# EAGLE schematic MasterPCB_transfer (EAGLE 9.6.2), part 3 of 3
## Sheet 12 of 12: Microcontroller Page holds general connections made to the microcontroller and associated local hardware
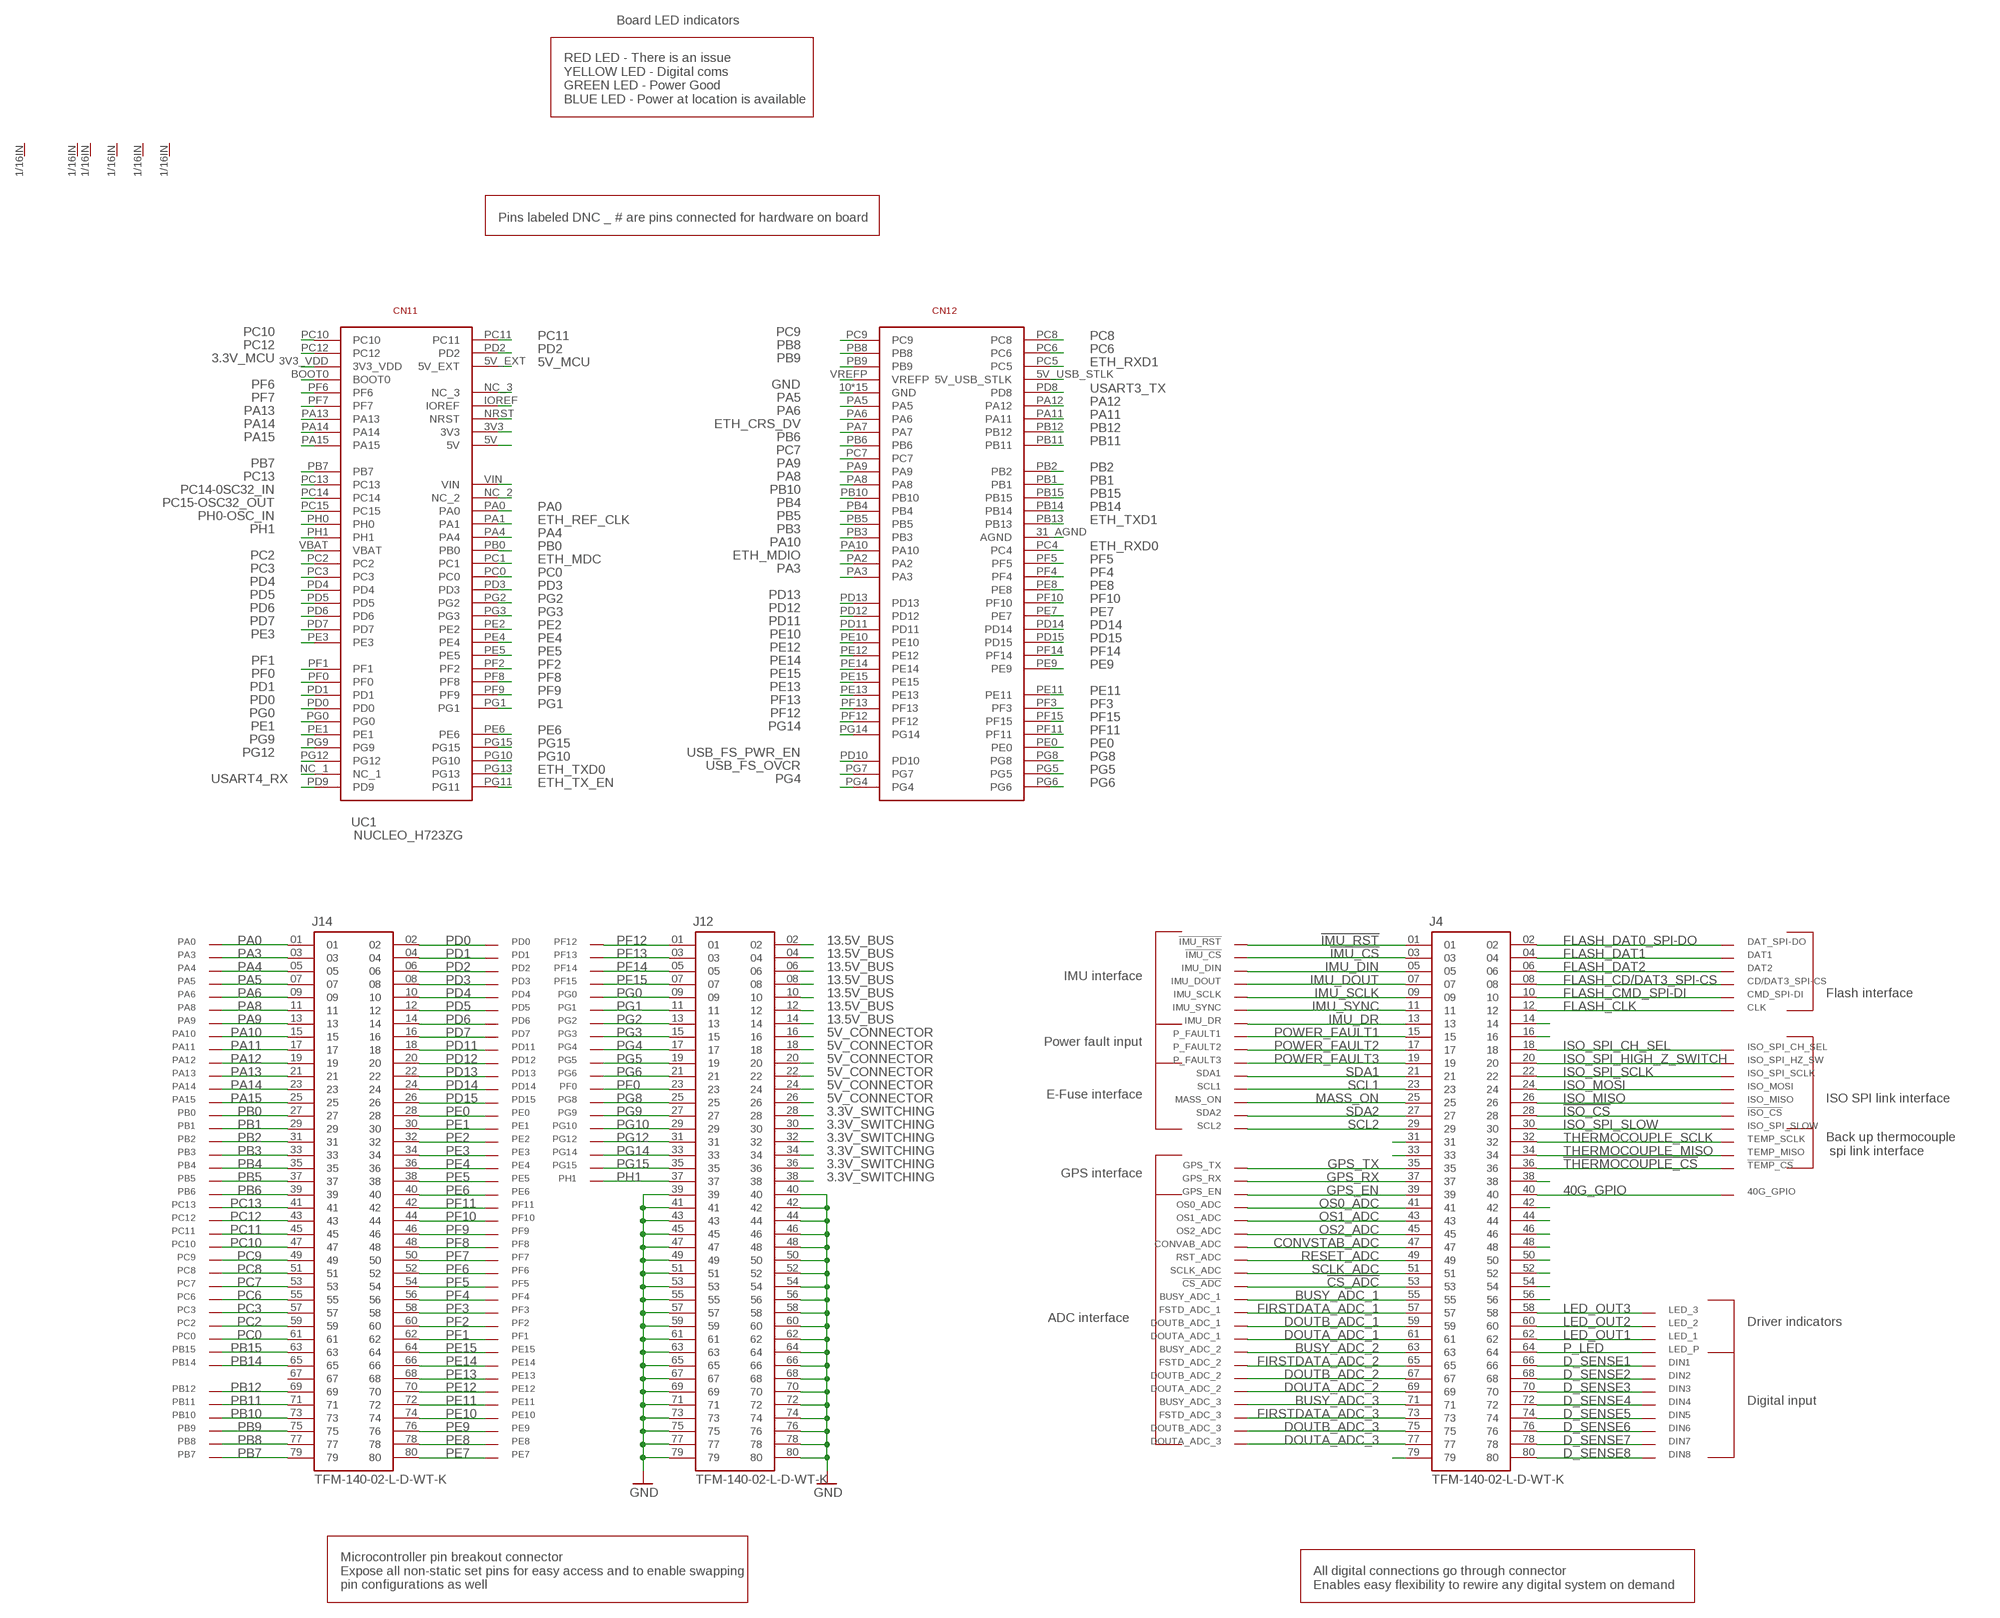
[diagram p20: schematic, sheet 12]

### Parts
40G_GPIO  SMALL_TP  [SMALL_TP]
!CS_ADC  SMALL_TP  [SMALL_TP]
!IMU_CS  SMALL_TP  [SMALL_TP]
!IMU_RST  SMALL_TP  [SMALL_TP]
!ISO_CS  SMALL_TP  [SMALL_TP]
!TEMP_CS  SMALL_TP  [SMALL_TP]
BUSY_ADC_1  SMALL_TP  [SMALL_TP]
BUSY_ADC_2  SMALL_TP  [SMALL_TP]
BUSY_ADC_3  SMALL_TP  [SMALL_TP]
CD/DAT3_SPI-CS  SMALL_TP  [SMALL_TP]
CLK  SMALL_TP  [SMALL_TP]
CMD_SPI-DI  SMALL_TP  [SMALL_TP]
CONVAB_ADC  SMALL_TP  [SMALL_TP]
DAT1  SMALL_TP  [SMALL_TP]
DAT2  SMALL_TP  [SMALL_TP]
DAT_SPI-DO  SMALL_TP  [SMALL_TP]
DIN1  SMALL_TP  [SMALL_TP]
DIN2  SMALL_TP  [SMALL_TP]
DIN3  SMALL_TP  [SMALL_TP]
DIN4  SMALL_TP  [SMALL_TP]
DIN5  SMALL_TP  [SMALL_TP]
DIN6  SMALL_TP  [SMALL_TP]
DIN7  SMALL_TP  [SMALL_TP]
DIN8  SMALL_TP  [SMALL_TP]
DOUTA_ADC_1  SMALL_TP  [SMALL_TP]
DOUTA_ADC_2  SMALL_TP  [SMALL_TP]
DOUTA_ADC_3  SMALL_TP  [SMALL_TP]
DOUTB_ADC_1  SMALL_TP  [SMALL_TP]
DOUTB_ADC_2  SMALL_TP  [SMALL_TP]
DOUTB_ADC_3  SMALL_TP  [SMALL_TP]
FSTD_ADC_1  SMALL_TP  [SMALL_TP]
FSTD_ADC_2  SMALL_TP  [SMALL_TP]
FSTD_ADC_3  SMALL_TP  [SMALL_TP]
GPS_EN  SMALL_TP  [SMALL_TP]
GPS_RX  SMALL_TP  [SMALL_TP]
GPS_TX  SMALL_TP  [SMALL_TP]
IMU_DIN  SMALL_TP  [SMALL_TP]
IMU_DOUT  SMALL_TP  [SMALL_TP]
IMU_DR  SMALL_TP  [SMALL_TP]
IMU_SCLK  SMALL_TP  [SMALL_TP]
IMU_SYNC  SMALL_TP  [SMALL_TP]
ISO_MISO  SMALL_TP  [SMALL_TP]
ISO_MOSI  SMALL_TP  [SMALL_TP]
ISO_SPI_CH_SEL  SMALL_TP  [SMALL_TP]
ISO_SPI_HZ_SW  SMALL_TP  [SMALL_TP]
ISO_SPI_SCLK  SMALL_TP  [SMALL_TP]
ISO_SPI_SLOW  SMALL_TP  [SMALL_TP]
J4  TFM-140-02-L-D-WT-K  [SAMTEC_TFM-140-02-L-D-WT-K]
J12  TFM-140-02-L-D-WT-K  [SAMTEC_TFM-140-02-L-D-WT-K]
J14  TFM-140-02-L-D-WT-K  [SAMTEC_TFM-140-02-L-D-WT-K]
LED_1  SMALL_TP  [SMALL_TP]
LED_2  SMALL_TP  [SMALL_TP]
LED_3  SMALL_TP  [SMALL_TP]
LED_P  SMALL_TP  [SMALL_TP]
MASS_ON  SMALL_TP  [SMALL_TP]
OS0_ADC  SMALL_TP  [SMALL_TP]
OS1_ADC  SMALL_TP  [SMALL_TP]
OS2_ADC  SMALL_TP  [SMALL_TP]
P_FAULT1  SMALL_TP  [SMALL_TP]
P_FAULT2  SMALL_TP  [SMALL_TP]
P_FAULT3  SMALL_TP  [SMALL_TP]
PA0  SMALL_TP  [SMALL_TP]
PA3  SMALL_TP  [SMALL_TP]
PA4  SMALL_TP  [SMALL_TP]
PA5  SMALL_TP  [SMALL_TP]
PA6  SMALL_TP  [SMALL_TP]
PA8  SMALL_TP  [SMALL_TP]
PA9  SMALL_TP  [SMALL_TP]
PA10  SMALL_TP  [SMALL_TP]
PA11  SMALL_TP  [SMALL_TP]
PA12  SMALL_TP  [SMALL_TP]
PA13  SMALL_TP  [SMALL_TP]
PA14  SMALL_TP  [SMALL_TP]
PA15  SMALL_TP  [SMALL_TP]
PB0  SMALL_TP  [SMALL_TP]
PB1  SMALL_TP  [SMALL_TP]
PB2  SMALL_TP  [SMALL_TP]
PB3  SMALL_TP  [SMALL_TP]
PB4  SMALL_TP  [SMALL_TP]
PB5  SMALL_TP  [SMALL_TP]
PB6  SMALL_TP  [SMALL_TP]
PB7  SMALL_TP  [SMALL_TP]
PB8  SMALL_TP  [SMALL_TP]
PB9  SMALL_TP  [SMALL_TP]
PB10  SMALL_TP  [SMALL_TP]
PB11  SMALL_TP  [SMALL_TP]
PB12  SMALL_TP  [SMALL_TP]
PB14  SMALL_TP  [SMALL_TP]
PB15  SMALL_TP  [SMALL_TP]
PC0  SMALL_TP  [SMALL_TP]
PC2  SMALL_TP  [SMALL_TP]
PC3  SMALL_TP  [SMALL_TP]
PC6  SMALL_TP  [SMALL_TP]
PC7  SMALL_TP  [SMALL_TP]
PC8  SMALL_TP  [SMALL_TP]
PC9  SMALL_TP  [SMALL_TP]
PC10  SMALL_TP  [SMALL_TP]
PC11  SMALL_TP  [SMALL_TP]
PC12  SMALL_TP  [SMALL_TP]
PC13  SMALL_TP  [SMALL_TP]
PD0  SMALL_TP  [SMALL_TP]
PD1  SMALL_TP  [SMALL_TP]
PD2  SMALL_TP  [SMALL_TP]
PD3  SMALL_TP  [SMALL_TP]
PD4  SMALL_TP  [SMALL_TP]
PD5  SMALL_TP  [SMALL_TP]
PD6  SMALL_TP  [SMALL_TP]
PD7  SMALL_TP  [SMALL_TP]
PD11  SMALL_TP  [SMALL_TP]
PD12  SMALL_TP  [SMALL_TP]
PD13  SMALL_TP  [SMALL_TP]
PD14  SMALL_TP  [SMALL_TP]
PD15  SMALL_TP  [SMALL_TP]
PE0  SMALL_TP  [SMALL_TP]
PE1  SMALL_TP  [SMALL_TP]
PE2  SMALL_TP  [SMALL_TP]
PE3  SMALL_TP  [SMALL_TP]
PE4  SMALL_TP  [SMALL_TP]
PE5  SMALL_TP  [SMALL_TP]
PE6  SMALL_TP  [SMALL_TP]
PE7  SMALL_TP  [SMALL_TP]
PE8  SMALL_TP  [SMALL_TP]
PE9  SMALL_TP  [SMALL_TP]
PE10  SMALL_TP  [SMALL_TP]
PE11  SMALL_TP  [SMALL_TP]
PE12  SMALL_TP  [SMALL_TP]
PE13  SMALL_TP  [SMALL_TP]
PE14  SMALL_TP  [SMALL_TP]
PE15  SMALL_TP  [SMALL_TP]
PF0  SMALL_TP  [SMALL_TP]
PF1  SMALL_TP  [SMALL_TP]
PF2  SMALL_TP  [SMALL_TP]
PF3  SMALL_TP  [SMALL_TP]
PF4  SMALL_TP  [SMALL_TP]
PF5  SMALL_TP  [SMALL_TP]
PF6  SMALL_TP  [SMALL_TP]
PF7  SMALL_TP  [SMALL_TP]
PF8  SMALL_TP  [SMALL_TP]
PF9  SMALL_TP  [SMALL_TP]
PF10  SMALL_TP  [SMALL_TP]
PF11  SMALL_TP  [SMALL_TP]
PF12  SMALL_TP  [SMALL_TP]
PF13  SMALL_TP  [SMALL_TP]
PF14  SMALL_TP  [SMALL_TP]
PF15  SMALL_TP  [SMALL_TP]
PG0  SMALL_TP  [SMALL_TP]
PG1  SMALL_TP  [SMALL_TP]
PG2  SMALL_TP  [SMALL_TP]
PG3  SMALL_TP  [SMALL_TP]
PG4  SMALL_TP  [SMALL_TP]
PG5  SMALL_TP  [SMALL_TP]
PG6  SMALL_TP  [SMALL_TP]
PG8  SMALL_TP  [SMALL_TP]
PG9  SMALL_TP  [SMALL_TP]
PG10  SMALL_TP  [SMALL_TP]
PG12  SMALL_TP  [SMALL_TP]
PG14  SMALL_TP  [SMALL_TP]
PG15  SMALL_TP  [SMALL_TP]
PH1  SMALL_TP  [SMALL_TP]
RST_ADC  SMALL_TP  [SMALL_TP]
SCL1  SMALL_TP  [SMALL_TP]
SCL2  SMALL_TP  [SMALL_TP]
SCLK_ADC  SMALL_TP  [SMALL_TP]
SDA1  SMALL_TP  [SMALL_TP]
SDA2  SMALL_TP  [SMALL_TP]
TEMP_MISO  SMALL_TP  [SMALL_TP]
TEMP_SCLK  SMALL_TP  [SMALL_TP]
U$5  THROUGH_HOLE  [1/16TH_BOLT]
U$7  THROUGH_HOLE  [1/16TH_BOLT]
U$9  THROUGH_HOLE  [1/16TH_BOLT]
U$10  THROUGH_HOLE  [1/16TH_BOLT]
U$14  THROUGH_HOLE  [1/16TH_BOLT]
U$15  THROUGH_HOLE  [1/16TH_BOLT]
UC1  NUCLEO_H723ZG  [NUCLEO_H723ZG]

### Nets
3.3V_MCU: UC1.3V3_VDD
3.3V_SWITCHING: J12.28 J12.30 J12.32 J12.34 J12.36 J12.38 ; also sheet 3,4
5V_CONNECTOR: J12.16 J12.18 J12.20 J12.22 J12.24 J12.26 ; also sheet 4
5V_MCU: UC1.5V_EXT ; also sheet 4
13.5V_BUS: J12.02 J12.04 J12.06 J12.08 J12.10 J12.12 J12.14 ; also sheet 2,4,5,6,11
40G_GPIO: 40G_GPIO.TP J4.40 ; also sheet 11
!CS_ADC: !CS_ADC.TP J4.53 ; also sheet 1,2
!IMU_CS: !IMU_CS.TP J4.03 ; also sheet 8
!IMU_RST: !IMU_RST.TP J4.01 ; also sheet 8
!ISO_CS: !ISO_CS.TP J4.28 ; also sheet 9
!THERMOCOUPLE_CS: !TEMP_CS.TP J4.36 ; also sheet 11
BUSY_ADC_1: BUSY_ADC_1.TP J4.55 ; also sheet 1
BUSY_ADC_2: BUSY_ADC_2.TP J4.63 ; also sheet 1
BUSY_ADC_3: BUSY_ADC_3.TP J4.71 ; also sheet 2
CONVSTAB_ADC: CONVAB_ADC.TP J4.47 ; also sheet 1,2
D_SENSE1: DIN1.TP J4.66 ; also sheet 3
D_SENSE2: DIN2.TP J4.68 ; also sheet 3
D_SENSE3: DIN3.TP J4.70 ; also sheet 3
D_SENSE4: DIN4.TP J4.72 ; also sheet 3
D_SENSE5: DIN5.TP J4.74 ; also sheet 3
D_SENSE6: DIN6.TP J4.76 ; also sheet 3
D_SENSE7: DIN7.TP J4.78 ; also sheet 3
D_SENSE8: DIN8.TP J4.80 ; also sheet 3
DOUTA_ADC_1: DOUTA_ADC_1.TP J4.61 ; also sheet 1
DOUTA_ADC_2: DOUTA_ADC_2.TP J4.69 ; also sheet 1
DOUTA_ADC_3: DOUTA_ADC_3.TP J4.77 ; also sheet 2
DOUTB_ADC_1: DOUTB_ADC_1.TP J4.59 ; also sheet 1
DOUTB_ADC_2: DOUTB_ADC_2.TP J4.67 ; also sheet 1
DOUTB_ADC_3: DOUTB_ADC_3.TP J4.75 ; also sheet 2
ETH_CRS_DV: UC1.PA7
ETH_MDC: UC1.PC1
ETH_MDIO: UC1.PA2
ETH_REF_CLK: UC1.PA1
ETH_RXD0: UC1.PC4
ETH_RXD1: UC1.PC5
ETH_TX_EN: UC1.PG11
ETH_TXD0: UC1.PG13
ETH_TXD1: UC1.PB13
FIRSTDATA_ADC_1: FSTD_ADC_1.TP J4.57 ; also sheet 1
FIRSTDATA_ADC_2: FSTD_ADC_2.TP J4.65 ; also sheet 1
FIRSTDATA_ADC_3: FSTD_ADC_3.TP J4.73 ; also sheet 2
FLASH_CD/DAT3_SPI-CS: CD/DAT3_SPI-CS.TP J4.08 ; also sheet 10
FLASH_CLK: CLK.TP J4.12 ; also sheet 10
FLASH_CMD_SPI-DI: CMD_SPI-DI.TP J4.10 ; also sheet 10
FLASH_DAT0_SPI-DO: DAT_SPI-DO.TP J4.02 ; also sheet 10
FLASH_DAT1: DAT1.TP J4.04 ; also sheet 10
FLASH_DAT2: DAT2.TP J4.06 ; also sheet 10
GND: J12.39 J12.40 J12.41 J12.42 J12.43 J12.44 J12.45 J12.46 J12.47 J12.48 J12.49 J12.50 J12.51 J12.52 J12.53 J12.54 J12.55 J12.56 J12.57 J12.58 J12.59 J12.60 J12.61 J12.62 J12.63 J12.64 J12.65 J12.66 J12.67 J12.68 J12.69 J12.70 J12.71 J12.72 J12.73 J12.74 J12.75 J12.76 J12.77 J12.78 J12.79 J12.80 UC1.10(GND) UC1.19(GND) UC1.40(GND) UC1.53(GND) UC1.64(GND) UC1.71(GND) UC1.72(GND) UC1.79(GND) UC1.91(GND) UC1.92(GND) UC1.93(GND) UC1.122(GND) UC1.131(GND) UC1.143(GND) UC1.144(GND) ; also sheet 1,2,3,4,5,6,7,8,9,10,11
GPS_EN: GPS_EN.TP J4.39 ; also sheet 7
GPS_RX: GPS_RX.TP J4.37 ; also sheet 7
GPS_TX: GPS_TX.TP J4.35 ; also sheet 7
IMU_DIN: IMU_DIN.TP J4.05 ; also sheet 8
IMU_DOUT: IMU_DOUT.TP J4.07 ; also sheet 8
IMU_DR: IMU_DR.TP J4.13 ; also sheet 8
IMU_SCLK: IMU_SCLK.TP J4.09 ; also sheet 8
IMU_SYNC: IMU_SYNC.TP J4.11 ; also sheet 8
ISO_MISO: ISO_MISO.TP J4.26 ; also sheet 9
ISO_MOSI: ISO_MOSI.TP J4.24 ; also sheet 9
ISO_SPI_CH_SEL: ISO_SPI_CH_SEL.TP J4.18 ; also sheet 9
ISO_SPI_HIGH_Z_SWITCH: ISO_SPI_HZ_SW.TP J4.20 ; also sheet 9
ISO_SPI_SCLK: ISO_SPI_SCLK.TP J4.22 ; also sheet 9
ISO_SPI_SLOW: ISO_SPI_SLOW.TP J4.30 ; also sheet 9
LED_OUT1: J4.62 LED_1.TP ; also sheet 3
LED_OUT2: J4.60 LED_2.TP ; also sheet 3
LED_OUT3: J4.58 LED_3.TP ; also sheet 3
MASS_ON: J4.25 MASS_ON.TP ; also sheet 11
N$2: J4.14
N$3: J4.16
N$4: J4.38
N$8: J4.56
N$9: J4.54
N$10: J4.52
N$11: J4.50
N$12: J4.48
N$13: J4.46
N$14: J4.44
N$15: J4.42
N$16: J4.31
N$20: J4.33
N$21: J4.79
N$554: UC1.BOOT0
N$566: UC1.VBAT
N$582: UC1.NC_1
N$605: UC1.NC_2
N$606: UC1.VIN
N$607: UC1.5V
N$608: UC1.3V3
N$609: UC1.NRST
N$610: UC1.IOREF
N$611: UC1.NC_3
N$618: UC1.VREFP
N$666: UC1.31_AGND(AGND)
N$677: UC1.5V_USB_STLK
OS0_ADC: J4.41 OS0_ADC.TP ; also sheet 1,2
OS1_ADC: J4.43 OS1_ADC.TP ; also sheet 1,2
OS2_ADC: J4.45 OS2_ADC.TP ; also sheet 1,2
P_LED: J4.64 LED_P.TP ; also sheet 3
PA0: J14.01 PA0.TP UC1.PA0
PA3: J14.03 PA3.TP UC1.PA3
PA4: J14.05 PA4.TP UC1.PA4
PA5: J14.07 PA5.TP UC1.PA5
PA6: J14.09 PA6.TP UC1.PA6
PA8: J14.11 PA8.TP UC1.PA8
PA9: J14.13 PA9.TP UC1.PA9
PA10: J14.15 PA10.TP UC1.PA10
PA11: J14.17 PA11.TP UC1.PA11
PA12: J14.19 PA12.TP UC1.PA12
PA13: J14.21 PA13.TP UC1.PA13
PA14: J14.23 PA14.TP UC1.PA14
PA15: J14.25 PA15.TP UC1.PA15
PB0: J14.27 PB0.TP UC1.PB0
PB1: J14.29 PB1.TP UC1.PB1
PB2: J14.31 PB2.TP UC1.PB2
PB3: J14.33 PB3.TP UC1.PB3
PB4: J14.35 PB4.TP UC1.PB4
PB5: J14.37 PB5.TP UC1.PB5
PB6: J14.39 PB6.TP UC1.PB6
PB7: J14.79 PB7.TP UC1.PB7
PB8: J14.77 PB8.TP UC1.PB8
PB9: J14.75 PB9.TP UC1.PB9
PB10: J14.73 PB10.TP UC1.PB10
PB11: J14.71 PB11.TP UC1.PB11
PB12: J14.69 PB12.TP UC1.PB12
PB14: J14.65 PB14.TP UC1.PB14
PB15: J14.63 PB15.TP UC1.PB15
PC0: J14.61 PC0.TP UC1.PC0
PC2: J14.59 PC2.TP UC1.PC2
PC3: J14.57 PC3.TP UC1.PC3
PC6: J14.55 PC6.TP UC1.PC6
PC7: J14.53 PC7.TP UC1.PC7
PC8: J14.51 PC8.TP UC1.PC8
PC9: J14.49 PC9.TP UC1.PC9
PC10: J14.47 PC10.TP UC1.PC10
PC11: J14.45 PC11.TP UC1.PC11
PC12: J14.43 PC12.TP UC1.PC12
PC13: J14.41 PC13.TP UC1.PC13
PC14-0SC32_IN: UC1.PC14
PC15-OSC32_OUT: UC1.PC15
PD0: J14.02 PD0.TP UC1.PD0
PD1: J14.04 PD1.TP UC1.PD1
PD2: J14.06 PD2.TP UC1.PD2
PD3: J14.08 PD3.TP UC1.PD3
PD4: J14.10 PD4.TP UC1.PD4
PD5: J14.12 PD5.TP UC1.PD5
PD6: J14.14 PD6.TP UC1.PD6
PD7: J14.16 PD7.TP UC1.PD7
PD11: J14.18 PD11.TP UC1.PD11
PD12: J14.20 PD12.TP UC1.PD12
PD13: J14.22 PD13.TP UC1.PD13
PD14: J14.24 PD14.TP UC1.PD14
PD15: J14.26 PD15.TP UC1.PD15
PE0: J14.28 PE0.TP UC1.PE0
PE1: J14.30 PE1.TP UC1.PE1
PE2: J14.32 PE2.TP UC1.PE2
PE3: J14.34 PE3.TP UC1.PE3
PE4: J14.36 PE4.TP UC1.PE4
PE5: J14.38 PE5.TP UC1.PE5
PE6: J14.40 PE6.TP UC1.PE6
PE7: J14.80 PE7.TP UC1.PE7
PE8: J14.78 PE8.TP UC1.PE8
PE9: J14.76 PE9.TP UC1.PE9
PE10: J14.74 PE10.TP UC1.PE10
PE11: J14.72 PE11.TP UC1.PE11
PE12: J14.70 PE12.TP UC1.PE12
PE13: J14.68 PE13.TP UC1.PE13
PE14: J14.66 PE14.TP UC1.PE14
PE15: J14.64 PE15.TP UC1.PE15
PF0: J12.23 PF0.TP UC1.PF0
PF1: J14.62 PF1.TP UC1.PF1
PF2: J14.60 PF2.TP UC1.PF2
PF3: J14.58 PF3.TP UC1.PF3
PF4: J14.56 PF4.TP UC1.PF4
PF5: J14.54 PF5.TP UC1.PF5
PF6: J14.52 PF6.TP UC1.PF6
PF7: J14.50 PF7.TP UC1.PF7
PF8: J14.48 PF8.TP UC1.PF8
PF9: J14.46 PF9.TP UC1.PF9
PF10: J14.44 PF10.TP UC1.PF10
PF11: J14.42 PF11.TP UC1.PF11
PF12: J12.01 PF12.TP UC1.PF12
PF13: J12.03 PF13.TP UC1.PF13
PF14: J12.05 PF14.TP UC1.PF14
PF15: J12.07 PF15.TP UC1.PF15
PG0: J12.09 PG0.TP UC1.PG0
PG1: J12.11 PG1.TP UC1.PG1
PG2: J12.13 PG2.TP UC1.PG2
PG3: J12.15 PG3.TP UC1.PG3
PG4: J12.17 PG4.TP UC1.PG4
PG5: J12.19 PG5.TP UC1.PG5
PG6: J12.21 PG6.TP UC1.PG6
PG8: J12.25 PG8.TP UC1.PG8
PG9: J12.27 PG9.TP UC1.PG9
PG10: J12.29 PG10.TP UC1.PG10
PG12: J12.31 PG12.TP UC1.PG12
PG14: J12.33 PG14.TP UC1.PG14
PG15: J12.35 PG15.TP UC1.PG15
PH0-OSC_IN: UC1.PH0
PH1: J12.37 PH1.TP UC1.PH1
POWER_FAULT1: J4.15 P_FAULT1.TP ; also sheet 4
POWER_FAULT2: J4.17 P_FAULT2.TP ; also sheet 4
POWER_FAULT3: J4.19 P_FAULT3.TP ; also sheet 4
RESET_ADC: J4.49 RST_ADC.TP ; also sheet 1,2
SCL1: J4.23 SCL1.TP ; also sheet 11
SCL2: J4.29 SCL2.TP ; also sheet 11
SCLK_ADC: J4.51 SCLK_ADC.TP ; also sheet 1,2
SDA1: J4.21 SDA1.TP ; also sheet 11
SDA2: J4.27 SDA2.TP ; also sheet 11
THERMOCOUPLE_MISO: J4.34 TEMP_MISO.TP ; also sheet 11
THERMOCOUPLE_SCLK: J4.32 TEMP_SCLK.TP ; also sheet 11
USART3_TX: UC1.PD8
USART4_RX: UC1.PD9
USB_FS_OVCR: UC1.PG7
USB_FS_PWR_EN: UC1.PD10
Unconnected: J14.67 U$5.1/16IN(THROUGH_HOLE) U$7.1/16IN(THROUGH_HOLE) U$9.1/16IN(THROUGH_HOLE) U$10.1/16IN(THROUGH_HOLE) U$14.1/16IN(THROUGH_HOLE) U$15.1/16IN(THROUGH_HOLE)

### Notes on the sheet
- Board LED indicators
- RED LED - There is an issue 
  YELLOW LED - Digital coms
  GREEN LED - Power Good
  BLUE LED - Power at location is available
- Pins labeled DNC _ # are pins connected for hardware on board
- IMU interface
- Flash interface
- Power fault input
- E-Fuse interface
- ISO SPI link interface
- Back up thermocouple
   spi link interface
- GPS interface
- ADC interface
- Driver indicators
- Digital input
- Microcontroller pin breakout connector
  Expose all non-static set pins for easy access and to enable swapping
  pin configurations as well
- All digital connections go through connector
  Enables easy flexibility to rewire any digital system on demand

## Library data of the parts
40G_GPIO !CS_ADC !IMU_CS !IMU_RST !ISO_CS !TEMP_CS BUSY_ADC_1-BUSY_ADC_3 CD/DAT3_SPI-CS CLK CMD_SPI-DI CONVAB_ADC DAT1 DAT2 DAT_SPI-DO DIN1-DIN8 DOUTA_ADC_1-DOUTA_ADC_3 DOUTB_ADC_1-DOUTB_ADC_3 FSTD_ADC_1-FSTD_ADC_3 GPS_EN GPS_RX GPS_TX IMU_DIN IMU_DOUT IMU_DR IMU_SCLK IMU_SYNC ISO_MISO ISO_MOSI ISO_SPI_CH_SEL ISO_SPI_HZ_SW ISO_SPI_SCLK ISO_SPI_SLOW LED_1-LED_3 LED_P MASS_ON OS0_ADC OS1_ADC OS2_ADC P_FAULT1-P_FAULT3 PA0 PA3-PA6 PA8-PA15 PB0 PB1-PB12 PB14 PB15 PC0 PC2 PC3 PC6-PC13 PD0 PD1-PD7 PD11-PD15 PE0 PE1-PE15 PF0 PF1-PF15 PG0 PG1-PG6 PG8-PG10 PG12 PG14 PG15 PH1 RST_ADC SCL1 SCL2 SCLK_ADC SDA1 SDA2 TEMP_MISO TEMP_SCLK = SamacSys_Parts:SMALL_TP
C1 C13 C16 C17 C22 C25 C27 C96 C98 C100 C102-C106 C108-C110 = SamacSys_Parts:C3216X7R1E106K160AE: TDK 1206 C 10uF Ceramic Multilayer Capacitor, 25 V dc, +125C, X7R Dielectric, +/-10% Source: Datasheet <https://componentsearchengine.com/Datasheets/1/C3216X7R1E106K160AE.pdf>; DESCRIPTION: TDK 1206 C 10uF Ceramic Multilayer Capacitor, 25 V dc, +125C, X7R Dielectric, +/-10%; HEIGHT: 0.75mm; MANUFACTURER_NAME: TDK; MANUFACTURER_PART_NUMBER: C3216X7R1E106K160AE; MOUSER_PART_NUMBER: 810-C3216X7R1E106KST; MOUSER_PRICE-STOCK: https://www.mouser.com/Search/Refine.aspx?Keyword=810-C3216X7R1E106KST
C2-C12 C14 C15 C18-C21 C23 C24 C173 C174 C190 C196 = SamacSys_Parts:CGA4J3X7R1H105K125AB: Multilayer Ceramic Capacitors MLCC - SMD/SMT CGA 0805 50V 1uF X7R 10% AEC-Q200 Source: Datasheet <https://product.tdk.com/system/files/dam/doc/product/capacitor/ceramic/mlcc/catalog/mlcc_automotive_general_en.pdf?ref_disty=mouser>; DESCRIPTION: Multilayer Ceramic Capacitors MLCC - SMD/SMT CGA 0805 50V 1uF X7R 10% AEC-Q200; HEIGHT: 1.25mm; MANUFACTURER_NAME: TDK; MANUFACTURER_PART_NUMBER: CGA4J3X7R1H105K125AB; MOUSER_PART_NUMBER: 810-CGA4J3X7R1H105K; MOUSER_STOCK_PRICE: https://www.mouser.com/ProductDetail/TDK/CGA4J3X7R1H105K125AB?qs=NRhsANhppD9cK8XQyI1JTg%3D%3D
C26 C33-C36 C41 C46 C65 C70-C73 C107 C116 C121 C126 C131 C136 C141 C146 C151 C156 C161 C166 C169 C170 C189 C191-C195 = SamacSys_Parts:GRM31C5C1E474JE01L: Multilayer Ceramic Capacitors MLCC - SMD/SMT Source: Datasheet; DESCRIPTION: Multilayer Ceramic Capacitors MLCC - SMD/SMT; HEIGHT: 1.8mm; MANUFACTURER_NAME: Murata Electronics; MANUFACTURER_PART_NUMBER: GRM31C5C1E474JE01L; MOUSER_PART_NUMBER: 81-GRM31C5C1E474JE1L; MOUSER_PRICE-STOCK: https://www.mouser.co.uk/ProductDetail/Murata-Electronics/GRM31C5C1E474JE01L?qs=hd1VzrDQEGj8GOC097EZLg%3D%3D
C28-C30 C39 C45 C48-C52 C54 C56-C60 C62 C74-C77 C79-C85 C87-C89 C101 C115 C120 C125 C130 C135 C140 C145 C150 C155 C160 C165 C176-C180 C182-C188 C197 C198 C200-C204 C206-C210 C212-C216 C218-C222 C224-C228 C230-C234 C236-C240 C242-C246 C248-C252 C254-C258 C260-C264 C266-C270 C272-C276 = SamacSys_Parts:CS0402KRX7R8BB104: CS0402KRX7R8BB104 Source: Datasheet; DESCRIPTION: CS0402KRX7R8BB104; HEIGHT: 0.65mm; MANUFACTURER_NAME: YAGEO (PHYCOMP); MANUFACTURER_PART_NUMBER: CS0402KRX7R8BB104; MOUSER_PART_NUMBER: 603-CS0402KRX78BB104; MOUSER_PRICE-STOCK: https://www.mouser.co.uk/ProductDetail/Yageo/CS0402KRX7R8BB104?qs=OCVh8QRf89CevdcE88rDSA%3D%3D
C37 C42-C44 C95 C97 C99 C112-C114 C117-C119 C122-C124 C127-C129 C132-C134 C137-C139 C142-C144 C147-C149 C152-C154 C157-C159 C162-C164 C167 C168 = SamacSys_Parts:GRM1555C1H822JE01D: Multilayer Ceramic Capacitors MLCC - SMD/SMT 8200pF
C38 C40 C63 C64 C66-C69 = SamacSys_Parts:CGA2B2C0G1H102J050BE: Multilayer Ceramic Capacitors MLCC - SMD/SMT 0402 50VDC 1nF 5% C0G AEC-Q200 Source: Datasheet <https://product.tdk.com/system/files/dam/doc/product/capacitor/ceramic/mlcc/catalog/mlcc_automotive_soft_en.pdf>; DESCRIPTION: Multilayer Ceramic Capacitors MLCC - SMD/SMT 0402 50VDC 1nF 5% C0G AEC-Q200; HEIGHT: 0.55mm; MANUFACTURER_NAME: TDK; MANUFACTURER_PART_NUMBER: CGA2B2C0G1H102J050BE; MOUSER_PART_NUMBER: 810-CGA2B2C0G1H102J5; MOUSER_PRICE-STOCK: https://www.mouser.co.uk/ProductDetail/TDK/CGA2B2C0G1H102J050BE?qs=P1JMDcb91o7BA6xd7%2FtTJw%3D%3D
C47 C53 C55 C61 C78 C86 C175 C181 C199 C205 C211 C217 C223 C229 C235 C241 C247 C253 C259 C265 C271 = SamacSys_Parts:C0402C103K3RAC7411: SMD Comm X7R, Ceramic, 0.01 uF, 10%, 25 VDC, 62.5 VDC, 125?C, -55?C, X7R, SMD, MLCC, Temperature Stable, Class II, 3.5 % , 100 GOhms, 1.21 mg, 0402, 1mm, 0.5mm, 0.5mm, 0.3mm, 0.3mm, 50000, 78 Weeks, 80 Source: Datasheet <https://content.kemet.com/datasheets/KEM_C1002_X7R_SMD.pdf>; DESCRIPTION: SMD Comm X7R, Ceramic, 0.01 uF, 10%, 25 VDC, 62.5 VDC, 125?C, -55?C, X7R, SMD, MLCC, Temperature Stable, Class II, 3.5 % , 100 GOhms, 1.21 mg, 0402, 1mm, 0.5mm, 0.5mm, 0.3mm, 0.3mm, 50000, 78 Weeks, 80; HEIGHT: 0.55mm; MANUFACTURER_NAME: KEMET; MANUFACTURER_PART_NUMBER: C0402C103K3RAC7411; MOUSER_PART_NUMBER: 80-C0402C103K3R7411; MOUSER_PRICE-STOCK: https://www.mouser.co.uk/ProductDetail/KEMET/C0402C103K3RAC7411?qs=A9KPa1hU2BRAaYVIc6Z8hw%3D%3D
C111 = SamacSys_Parts:GRT21BC8YA475KE13K: Capacitor GRT21 L=2.0mm W=1.25mm T=1.25mm Source: Datasheet <https://psearch.en.murata.com/capacitor/product/GRT21BC8YA475KE13#.html>; DESCRIPTION: Capacitor GRT21 L=2.0mm W=1.25mm T=1.25mm; HEIGHT: 1.35mm; MANUFACTURER_NAME: Murata Electronics; MANUFACTURER_PART_NUMBER: GRT21BC8YA475KE13K; MOUSER_PART_NUMBER: 81-GRT21BC8YA475KE3K; MOUSER_PRICE-STOCK: https://www.mouser.co.uk/ProductDetail/Murata-Electronics/GRT21BC8YA475KE13K?qs=d0WKAl%252BL4KbclushYQ%252Bahg%3D%3D
C171 C172 = SamacSys_Parts:06035C270JAT2A: Capacitor, 0603 27PF +/-5% 50V Source: Datasheet <https://componentsearchengine.com/Datasheets/1/06031A100FAT2A.pdf>; DESCRIPTION: Capacitor, 0603 27PF +/-5% 50V; HEIGHT: 0.9mm; MANUFACTURER_NAME: AVX; MANUFACTURER_PART_NUMBER: 06035C270JAT2A
D1-D44 D46 D47 D49-D74 D76 D77 = SamacSys_Parts:PTVS12VS1UR,115: PTVSxS1UR series - 400 W Transient Voltage Suppressor Source: Datasheet <https://assets.nexperia.com/documents/data-sheet/PTVSXS1UR_SER.pdf>; DESCRIPTION: PTVSxS1UR series - 400 W Transient Voltage Suppressor; HEIGHT: mm; MANUFACTURER_NAME: Nexperia; MANUFACTURER_PART_NUMBER: PTVS12VS1UR,115; MOUSER_PART_NUMBER: 771-PTVS12VS1UR115; MOUSER_PRICE-STOCK: https://www.mouser.co.uk/ProductDetail/Nexperia/PTVS12VS1UR115?qs=LMSg3oBIm%2FiWSHvsyxWiLg%3D%3D
D45 D48 D75 D78-D82 D84-D87 = SamacSys_Parts:RSR025N03HZGTL: MOSFET 30V N-CHANNEL 2.5A Source: Datasheet <https://componentsearchengine.com/Datasheets/2/RSR025N03HZGTL.pdf>; DESCRIPTION: MOSFET 30V N-CHANNEL 2.5A; HEIGHT: 1mm; MANUFACTURER_NAME: ROHM Semiconductor; MANUFACTURER_PART_NUMBER: RSR025N03HZGTL; MOUSER_PART_NUMBER: 755-RSR025N03HZGTL; MOUSER_PRICE-STOCK: https://www.mouser.co.uk/ProductDetail/ROHM-Semiconductor/RSR025N03HZGTL?qs=qSfuJ%252Bfl%2Fd6oUAHuBzgCAw%3D%3D
IC1-IC3 IC24-IC30 IC35-IC37 IC39-IC50 IC53-IC79 = SamacSys_Parts:NCS21911SN2T1G: Operational Amplifiers - Op Amps 2 MHz Source: Datasheet <https://www.arrow.com/en/products/ncs21911sn2t1g/on-semiconductor>; DESCRIPTION: Operational Amplifiers - Op Amps 2 MHz; HEIGHT: 1.1mm; MANUFACTURER_NAME: ON Semiconductor; MANUFACTURER_PART_NUMBER: NCS21911SN2T1G; MOUSER_PART_NUMBER: 863-NCS21911SN2T1G; MOUSER_PRICE-STOCK: https://www.mouser.co.uk/ProductDetail/onsemi/NCS21911SN2T1G?qs=%252B6g0mu59x7Ix%2FTFBhvJ5Cw%3D%3D
IC4 IC11-IC23 = SamacSys_Parts:LTC4222CUH#PBF: Hot Swap Voltage Controllers Dual Hot Swap Controller w/ADC and I2C Source: Datasheet <https://www.mouser.com/datasheet/2/609/4222fb-1270163.pdf>; DESCRIPTION: Hot Swap Voltage Controllers Dual Hot Swap Controller w/ADC and I2C; HEIGHT: 0.75; MANUFACTURER_NAME: Analog Devices; MANUFACTURER_PART_NUMBER: LTC4222CUH#PBF; MOUSER_PART_NUMBER: 584-LTC4222CUH#PBF; MOUSER_PRICE-STOCK: https://www.mouser.com/ProductDetail/Analog-Devices/LTC4222CUHPBF?qs=hVkxg5c3xu9PWFTJ4vRWUw%3D%3D
IC5 IC6 IC9 = SamacSys_Parts:LP38692SDX-5.0_NOPB: 1A Low Dropout CMOS Linear Regulators, Stable with Ceramic Output Capacitors Source: Datasheet <https://www.ti.com/lit/ds/symlink/lp38692.pdf?ts=1619508645090&ref_url=https%3A%2F%2Fwww.ti.com%2Fstore%2Fti%2Fen%2Fp%2Fproduct%2F%3Fp%3DLP38692SDX-5.0%2FNOPB>; DESCRIPTION: 1A Low Dropout CMOS Linear Regulators, Stable with Ceramic Output Capacitors; HEIGHT: 0.8mm; MANUFACTURER_NAME: Texas Instruments; MANUFACTURER_PART_NUMBER: LP38692SDX-5.0/NOPB; MOUSER_PART_NUMBER: 926-LP38692SDX50NOPB; MOUSER_PRICE-STOCK: https://www.mouser.co.uk/ProductDetail/Texas-Instruments/LP38692SDX-50-NOPB?qs=1FNqv8aZn1S8j5WDo5fviA%3D%3D
IC7 IC8 IC10 = SamacSys_Parts:LDL1117S33R: STMICROELECTRONICS - LDL1117S33R - LDO, FIXED, 3.3V, 1.2A, SOT-223-3 Source: Datasheet <https://componentsearchengine.com/Datasheets/2/LDL1117S33R.pdf>; DESCRIPTION: STMICROELECTRONICS - LDL1117S33R - LDO, FIXED, 3.3V, 1.2A, SOT-223-3; HEIGHT: 1.8mm; MANUFACTURER_NAME: STMicroelectronics; MANUFACTURER_PART_NUMBER: LDL1117S33R; MOUSER_PART_NUMBER: 511-LDL1117S33R; MOUSER_PRICE-STOCK: https://www.mouser.co.uk/ProductDetail/STMicroelectronics/LDL1117S33R?qs=AQlKX63v8Rt9Bf6AWSrbFg%3D%3D
IC31 = SamacSys_Parts:ADIS16500AMLZ: IMUs - Inertial Measurement Units 6 DOF Prec IMU, 40g (2000 DPS DNR) Source: Datasheet <https://componentsearchengine.com/Datasheets/1/ADIS16500AMLZ.pdf>; DESCRIPTION: IMUs - Inertial Measurement Units 6 DOF Prec IMU, 40g (2000 DPS DNR); HEIGHT: 6.077mm; MANUFACTURER_NAME: Analog Devices; MANUFACTURER_PART_NUMBER: ADIS16500AMLZ; MOUSER_PART_NUMBER: 584-ADIS16500AMLZ; MOUSER_PRICE-STOCK: https://www.mouser.co.uk/ProductDetail/Analog-Devices/ADIS16500AMLZ?qs=wnTfsH77Xs6CVAUqSdwQ2w%3D%3D
IC32 = SamacSys_Parts:LTC6820IUD#PBF: Interface - Specialized isoSPI Iso Communications Int Source: Datasheet <https://www.analog.com/media/en/technical-documentation/data-sheets/6820fb.pdf>; DESCRIPTION: Interface - Specialized isoSPI Iso Communications Int; HEIGHT: 0.8mm; MANUFACTURER_NAME: Analog Devices; MANUFACTURER_PART_NUMBER: LTC6820IUD#PBF; MOUSER_PART_NUMBER: 584-LTC6820IUD#PBF; MOUSER_PRICE-STOCK: https://www.mouser.co.uk/ProductDetail/Analog-Devices/LTC6820IUDPBF?qs=hVkxg5c3xu96S49pvln6gg%3D%3D
IC33 = SamacSys_Parts:CBTL01023GM,115
IC34 = SamacSys_Parts:MAX889TESA+: Charge Pump INV -2.5V to -5.5V 200mA Source: Datasheet <https://datasheet.datasheetarchive.com/originals/distributors/Datasheets-18/DSA-340436.pdf>; DESCRIPTION: Charge Pump INV -2.5V to -5.5V 200mA; HEIGHT: 1.75mm; MANUFACTURER_NAME: Maxim Integrated; MANUFACTURER_PART_NUMBER: MAX889TESA+; MOUSER_PART_NUMBER: 700-MAX889TESA; MOUSER_PRICE-STOCK: https://www.mouser.co.uk/ProductDetail/Maxim-Integrated/MAX889TESA%2b?qs=1THa7WoU59FzV%2Fuei5Yruw%3D%3D
IC38 IC51 IC52 = SamacSys_Parts:ADS8588HIPM: Analog to Digital Converters - ADC 16-Bit 500kSPS 8-Channel Simultaneous-Sampling ADC With Bipolar Inputs on a Single Supply 64-LQFP -40 to 125 Source: Datasheet <http://www.ti.com/lit/ds/symlink/ads8588h.pdf>
J1 = SamacSys_Parts:SAMTEC-SMM-104-02-X-D
J2 = SamacSys_Parts:SAMTEC-CLP-106-02-X-D
J3 = SamacSys_Parts:MEM2051-00-195-00-A: MICRO SD PUSH PUSH, OPEN, SMT, 1 Source: Datasheet <https://gct.co/files/drawings/mem2051.pdf>; DESCRIPTION: MICRO SD PUSH PUSH, OPEN, SMT, 1; HEIGHT: 2.05mm; MANUFACTURER_NAME: GCT (GLOBAL CONNECTOR TECHNOLOGY); MANUFACTURER_PART_NUMBER: MEM2051-00-195-00-A; MOUSER_PART_NUMBER: 640-MEM20510019500A; MOUSER_PRICE-STOCK: https://www.mouser.co.uk/ProductDetail/GCT/MEM2051-00-195-00-A?qs=KUoIvG%2F9Ilat7yfJRNWXUQ%3D%3D
J4-J6 J12 J14 = SamacSys_Parts:TFM-140-02-L-D-WT-K; MANUFACTURER: SAMTEC; PARTREV: Q; STANDARD: Manufacturer Recommendations
J9 = SamacSys_Parts:SSM-109-L-SV; MANUFACTURER: SAMTEC
LED1 LED4 LED6 LED9 LED11 LED14 LED16 LED19 LED21 LED24 LED26 LED29 LED31 LED34 LED36 LED39 LED41 LED44 LED46 LED49 LED51 LED54 LED56 LED59 LED61 LED64 LED66 LED69 = SamacSys_Parts:APHD1608LSURCK: Standard LEDs - SMD 0603 Dome Lens LED Red- 630nm Source: Datasheet <http://www.kingbrightusa.com/images/catalog/SPEC/APHD1608LSURCK.pdf>; DESCRIPTION: Standard LEDs - SMD 0603 Dome Lens LED Red- 630nm; HEIGHT: 0.8mm; MANUFACTURER_NAME: Kingbright; MANUFACTURER_PART_NUMBER: APHD1608LSURCK; MOUSER_PART_NUMBER: 604-APHD1608LSURCK; MOUSER_PRICE-STOCK: https://www.mouser.co.uk/ProductDetail/Kingbright/APHD1608LSURCK?qs=AQlKX63v8RvwTLDG%2F6aYFA%3D%3D
LED2 LED7 LED12 LED17 LED22 LED27 LED32 LED37 LED42 LED47 LED52 LED57 LED62 LED67 LED85-LED96 = SamacSys_Parts:AA3021LSYSK_J3-TR: Standard LEDs - SMD 3mmX2mm SMD LED LAMP SB YELLOW Source: Datasheet <https://eagle.componentsearchengine.com/Datasheets/1/AA3021LSYSK_J3-TR.pdf>; DESCRIPTION: Standard LEDs - SMD 3mmX2mm SMD LED LAMP SB YELLOW; HEIGHT: 1.3mm; MANUFACTURER_NAME: Kingbright; MANUFACTURER_PART_NUMBER: AA3021LSYSK/J3-TR; MOUSER_PART_NUMBER: 604-AA3021LSYSK/J3TR; MOUSER_PRICE-STOCK: https://www.mouser.co.uk/ProductDetail/Kingbright/AA3021LSYSK-J3-TR?qs=Oo40KB9lBTmS1V8p5PSO3Q%3D%3D
LED3 LED5 LED8 LED10 LED13 LED15 LED18 LED20 LED23 LED25 LED28 LED30 LED33 LED35 LED38 LED40 LED43 LED45 LED48 LED50 LED53 LED55 LED58 LED60 LED63 LED65 LED68 LED70 = SamacSys_Parts:APTD1608LCGCK: Standard LEDs - SMD 0603 Dome Lens LED Green- 570nm Source: Datasheet; DESCRIPTION: Standard LEDs - SMD 0603 Dome Lens LED Green- 570nm; HEIGHT: mm; MANUFACTURER_NAME: Kingbright; MANUFACTURER_PART_NUMBER: APTD1608LCGCK; MOUSER_PART_NUMBER: 604-APTD1608LCGCK; MOUSER_PRICE-STOCK: https://www.mouser.co.uk/ProductDetail/Kingbright/APTD1608LCGCK?qs=AQlKX63v8Rv%252Bp7eo1xBjCA%3D%3D
LED71-LED84 = SamacSys_Parts:SMLD12BN1WT86: Standard LEDs - SMD Blue 470nm; 40mcd 0603; 66mW Source: Datasheet <https://datasheet.datasheetarchive.com/originals/distributors/Datasheets_SAMA/8f824a900f8c9a143b1c3640e6aee7b7.pdf>; DESCRIPTION: Standard LEDs - SMD Blue 470nm; 40mcd 0603; 66mW; HEIGHT: 0.65mm; MANUFACTURER_NAME: ROHM Semiconductor; MANUFACTURER_PART_NUMBER: SMLD12BN1WT86; MOUSER_PART_NUMBER: 755-SMLD12BN1WT86; MOUSER_PRICE-STOCK: https://www.mouser.co.uk/ProductDetail/ROHM-Semiconductor/SMLD12BN1WT86?qs=qSfuJ%252Bfl%2Fd43hcPp9hYPwA%3D%3D
LED97-LED114 = SamacSys_Parts:ASMT-URB4-YU802: LED Uni-Color Red Chip LED 2-Pin PLCC Source: Datasheet; DESCRIPTION: LED Uni-Color Red Chip LED 2-Pin PLCC; HEIGHT: 2.1mm; MANUFACTURER_NAME: Avago Technologies; MANUFACTURER_PART_NUMBER: ASMT-URB4-YU802; MOUSER_PART_NUMBER: 630-ASMT-URB4-YU802; MOUSER_PRICE-STOCK: https://www.mouser.co.uk/ProductDetail/Broadcom-Avago/ASMT-URB4-YU802?qs=r5DSvlrkXmIfiRQRwTZD6w%3D%3D
M1-M28 = SamacSys_Parts:NTLUS4C12NTAG
R1 R5 R9 R13 R17 R21 R25 R29 R73 R77 R81 R85 R98 R105 R109 R113 R151 R155 R159 R163 R207 = SamacSys_Parts:RC0402FR-075K23L: YAGEO (PHYCOMP) RC0402F Source: Datasheet <https://datasheet.datasheetarchive.com/originals/distributors/Datasheets_SAMA/902f9e387b938f871d31120f5fc1d65e.pdf>; DESCRIPTION: YAGEO (PHYCOMP) RC0402F; HEIGHT: 0.4mm; MANUFACTURER_NAME: KEMET; MANUFACTURER_PART_NUMBER: RC0402FR-075K23L; MOUSER_PART_NUMBER: 603-RC0402FR-075K23L; MOUSER_PRICE-STOCK: https://www.mouser.co.uk/ProductDetail/YAGEO/RC0402FR-075K23L?qs=Is6ZsIPfHkZeFY7FIZZ3dg%3D%3D
R2 R6 R10 R14 R18 R22 R26 R30 R74 R78 R82 R86 R102 R106 R110 R114 R152 R156 R160 R201 R209 = SamacSys_Parts:RC0402FR-0793K1L: Thick Film Resistors 93.1K OHM 1% Source: Datasheet <https://www.mouser.tw/datasheet/2/447/PYu-RC_Group_51_RoHS_L_9-1314892.pdf>; DESCRIPTION: Thick Film Resistors 93.1K OHM 1%; HEIGHT: 0.4mm; MANUFACTURER_NAME: KEMET; MANUFACTURER_PART_NUMBER: RC0402FR-0793K1L; MOUSER_PART_NUMBER: 603-RC0402FR-0793K1L
R3 R4 R7 R8 R11 R12 R15 R16 R19 R20 R23 R24 R27 R28 R31 R32 R59-R61 R75 R76 R79 R80 R83 R84 R87 R88 R103 R104 R107 R108 R111 R112 R115 R116 R147-R150 R153 R154 R157 R158 R161 R162 R203 R205 R211 R221 = SamacSys_Parts:CRCW04021K30FKTD: Thick Film Resistors - SMD 1/16watt 1.3Kohms 1% Source: Datasheet <https://componentsearchengine.com/Datasheets/1/CRCW04021K30FKTD.pdf>; DESCRIPTION: Thick Film Resistors - SMD 1/16watt 1.3Kohms 1%; HEIGHT: 0.4mm; MANUFACTURER_NAME: Vishay; MANUFACTURER_PART_NUMBER: CRCW04021K30FKTD; MOUSER_PART_NUMBER: 71-CRCW0402-1.3K; MOUSER_PRICE-STOCK: https://www.mouser.com/Search/Refine.aspx?Keyword=71-CRCW0402-1.3K
R33 R35 R37 R39 R43 R45 R47 R49 R459-R470 R504 R505 R507 R509 = SamacSys_Parts:MCS0402MD1002DE000: Thin Film Resistors - SMD .1W 10Kohms .5% 0402 25ppm Auto Source: Datasheet <https://componentsearchengine.com/Datasheets/1/MCS0402MD1002DE000.pdf>; DESCRIPTION: Thin Film Resistors - SMD .1W 10Kohms .5% 0402 25ppm Auto; HEIGHT: 0.37mm; MANUFACTURER_NAME: Vishay; MANUFACTURER_PART_NUMBER: MCS0402MD1002DE000; MOUSER_PART_NUMBER: 594-MCS0402MD1002DE0; MOUSER_PRICE-STOCK: http://www.mouser.com/Search/ProductDetail.aspx?qs=EzBFWPtgsb0jQNGsPHo%2fIQ%3d%3d
R34 R36 R38 R40 R42 R44 R46 R48 R50 R52 R54 R56 R477 R478 R486 R487 R495 R496 = SamacSys_Parts:MCS04020C1001FE000: VISHAY - MCS04020C1001FE000 - RES, THIN FILM, 1K, 1%, 50V, 0402 Source: Datasheet <http://www.vishay.com/docs/28705/mcx0x0xpro.pdf>; DESCRIPTION: VISHAY - MCS04020C1001FE000 - RES, THIN FILM, 1K, 1%, 50V, 0402; HEIGHT: 0.37mm; MANUFACTURER_NAME: Vishay; MANUFACTURER_PART_NUMBER: MCS04020C1001FE000; MOUSER_PART_NUMBER: 594-MCS04020C1001FE0; MOUSER_PRICE-STOCK: https://www.mouser.co.uk/ProductDetail/Vishay-Beyschlag/MCS04020C1001FE000?qs=7ZE6F4QMOBb1MbBpUQXFCA%3D%3D
R41 R51 R53 R55 = SamacSys_Parts:ERA-2AKD240X: Metal Thin Film Chip Resistor, 0402, 0.063W Source: Datasheet <http://industrial.panasonic.com/cdbs/www-data/pdf/RDM0000/AOA0000C307.pdf>; DESCRIPTION: Metal Thin Film Chip Resistor, 0402, 0.063W; HEIGHT: 0.4mm; MANUFACTURER_NAME: Panasonic; MANUFACTURER_PART_NUMBER: ERA-2AKD240X; MOUSER_PART_NUMBER: 667-ERA-2AKD240X; MOUSER_PRICE-STOCK: https://www.mouser.co.uk/ProductDetail/Panasonic/ERA-2AKD240X?qs=nho8PGNfA6qIwHvMraZ9Jw%3D%3D
R57 R58 R65-R72 R117-R124 = SamacSys_Parts:ERJ-PA3D1400V: Anti-Surge Thick Film Chip Resistor, 0603 Source: Datasheet <https://industrial.panasonic.com/cdbs/www-data/pdf/RDO0000/AOA0000C331.pdf>; DESCRIPTION: Anti-Surge Thick Film Chip Resistor, 0603; HEIGHT: 0.55mm; MANUFACTURER_NAME: Panasonic; MANUFACTURER_PART_NUMBER: ERJ-PA3D1400V
R62-R64 = SamacSys_Parts:CR0402-FX-9310GLF: Thick Film Resistors - SMD CHIP RESISTOR Source: Datasheet <https://componentsearchengine.com/Datasheets/1/CR0402-FX-9310GLF.pdf>; DESCRIPTION: Thick Film Resistors - SMD CHIP RESISTOR; HEIGHT: 0.4mm; MANUFACTURER_NAME: Bourns; MANUFACTURER_PART_NUMBER: CR0402-FX-9310GLF; MOUSER_PART_NUMBER: 652-CR0402FX9310GLF; MOUSER_PRICE-STOCK: https://www.mouser.com/Search/Refine.aspx?Keyword=652-CR0402FX9310GLF
R89 R101 R136 R164 R174 R185 R195 R212 R223 R246 R256 R267 R277 R288 R298 R309 R319 R330 R340 R351 R361 R372 R382 R393 R403 R414 R424 R435 R479 = SamacSys_Parts:CRCW040212K0FKTD: Thick Film Resistors - SMD 1/16watt 12Kohms 1% Source: Datasheet <http://www.vishay.com/docs/20035/dcrcwe3.pdf>; DESCRIPTION: Thick Film Resistors - SMD 1/16watt 12Kohms 1%; HEIGHT: 0.4mm; MANUFACTURER_NAME: Vishay; MANUFACTURER_PART_NUMBER: CRCW040212K0FKTD; MOUSER_PART_NUMBER: 71-CRCW0402-12K; MOUSER_PRICE-STOCK: https://www.mouser.co.uk/ProductDetail/Vishay-Dale/CRCW040212K0FKTD?qs=23HxBOW7cwzmWHTPf7MCpg%3D%3D
R90 R127 R137 R165 R175 R186 R196 R213 R224 R247 R257 R268 R278 R289 R299 R310 R320 R331 R341 R352 R362 R373 R383 R394 R404 R415 R425 R436 = SamacSys_Parts:CRCW0402510RFKEDC: D10/CRCW0402-C 100 510R 1% ET7 Source: Datasheet <https://componentsearchengine.com/Datasheets/1/CRCW0402510RFKEDC.pdf>; DESCRIPTION: D10/CRCW0402-C 100 510R 1% ET7; HEIGHT: 0.35mm; MANUFACTURER_NAME: Vishay; MANUFACTURER_PART_NUMBER: CRCW0402510RFKEDC; MOUSER_PART_NUMBER: 71-CRCW0402510RFKEDC; MOUSER_PRICE-STOCK: https://www.mouser.co.uk/ProductDetail/Vishay-Dale/CRCW0402510RFKEDC?qs=E3Y5ESvWgWP1jG%252BFHDK9QQ%3D%3D
R91 R128 R138 R166 R176 R187 R197 R214 R225 R248 R258 R269 R279 R290 R300 R311 R321 R332 R342 R353 R363 R374 R384 R395 R405 R416 R426 R437 = SamacSys_Parts:CRCW04021K05FKED: RESISTOR, 0402 1.05K Ohms +/-1% 0.063 W Source: Datasheet <http://www.vishay.com/docs/20035/dcrcwe3.pdf>; DESCRIPTION: RESISTOR, 0402 1.05K Ohms +/-1% 0.063 W; HEIGHT: 0.4mm; MANUFACTURER_NAME: Vishay; MANUFACTURER_PART_NUMBER: CRCW04021K05FKED; MOUSER_PART_NUMBER: 71-CRCW04021K05FKED; MOUSER_PRICE-STOCK: https://www.mouser.co.uk/ProductDetail/Vishay-Dale/CRCW04021K05FKED?qs=w%2FDOYfJWiB6ciIUIOR%2FeYQ%3D%3D
R92 R129 R139 R167 R177 R188 R198 R215 R226 R249 R259 R270 R280 R291 R301 R312 R322 R333 R343 R354 R364 R375 R385 R396 R406 R417 R427 R438 = SamacSys_Parts:ERJ-2BWFR050X: Low Resistance Thick Film Chip Resistor, 0402, 0.25W Source: Datasheet <http://industrial.panasonic.com/cdbs/www-data/pdf/RDN0000/AOA0000C313.pdf>; DESCRIPTION: Low Resistance Thick Film Chip Resistor, 0402, 0.25W; HEIGHT: mm; MANUFACTURER_NAME: Panasonic; MANUFACTURER_PART_NUMBER: ERJ-2BWFR050X; MOUSER_PART_NUMBER: 667-ERJ-2BWFR050X; MOUSER_PRICE-STOCK: https://www.mouser.co.uk/ProductDetail/Panasonic/ERJ-2BWFR050X?qs=22lEN67Lqx6tfflDqflZ%2Fg%3D%3D
R93 R130 R140 R168 R178 R189 R199 R216 R228 R250 R260 R271 R281 R292 R302 R313 R323 R334 R344 R355 R365 R376 R386 R397 R407 R418 R428 R439 = SamacSys_Parts:ESR01MZPJ100: Thick Film Resistors - SMD 0402 10ohm 5% Anti Surge AEC-Q200 Source: Datasheet <https://datasheet.datasheetarchive.com/originals/distributors/DKDS-18/356400.pdf>; DESCRIPTION: Thick Film Resistors - SMD 0402 10ohm 5% Anti Surge AEC-Q200; HEIGHT: 0.4mm; MANUFACTURER_NAME: ROHM Semiconductor; MANUFACTURER_PART_NUMBER: ESR01MZPJ100; MOUSER_PART_NUMBER: 755-ESR01MZPJ100; MOUSER_PRICE-STOCK: https://www.mouser.co.uk/ProductDetail/ROHM-Semiconductor/ESR01MZPJ100?qs=493kPxzlxfLwO%252B9NWGdzwA%3D%3D
R94 R131 R141 R169 R179 R190 R200 R217 R240 R251 R261 R272 R282 R293 R303 R314 R324 R335 R345 R356 R366 R377 R387 R398 R408 R419 R429 R440 R488 R489 R497 R498 = SamacSys_Parts:RC0402JR-1015KL: Thick Film Resistors - SMD 15kOhms 1/16W 0402 5% Source: Datasheet <http://www.yageo.com/documents/recent/PYu-RC0402_51_RoHS_L_6_r.pdf>; DESCRIPTION: Thick Film Resistors - SMD 15kOhms 1/16W 0402 5%; HEIGHT: 0.4mm; MANUFACTURER_NAME: YAGEO (PHYCOMP); MANUFACTURER_PART_NUMBER: RC0402JR-1015KL; MOUSER_PART_NUMBER: 603-RC0402JR-1015KL; MOUSER_PRICE-STOCK: https://www.mouser.co.uk/ProductDetail/YAGEO/RC0402JR-1015KL?qs=qpJ%252B%252B%252Bdg6p0HdNhrh2Sl2A%3D%3D
R95 R132 R142 R170 R180 R191 R202 R218 R241 R252 R262 R273 R283 R294 R304 R315 R325 R336 R346 R357 R367 R378 R388 R399 R409 R420 R430 R441 R480 = SamacSys_Parts:CR0402-FX-1022GLF: Thick Film Resistors - SMD 10.2KOHM 1/16WATT 1% Source: Datasheet <https://www.bourns.com/pdfs/CR0402.pdf>; DESCRIPTION: Thick Film Resistors - SMD 10.2KOHM 1/16WATT 1%; HEIGHT: 0.4mm; MANUFACTURER_NAME: Bourns; MANUFACTURER_PART_NUMBER: CR0402-FX-1022GLF; MOUSER_PART_NUMBER: 652-CR0402-FX1022GLF; MOUSER_PRICE-STOCK: https://www.mouser.co.uk/ProductDetail/Bourns/CR0402-FX-1022GLF?qs=URDPQ%2Fj0cz0dXXje%252BNROsQ%3D%3D
R96 R133 R143 R171 R181 R192 R204 R219 R242 R253 R263 R274 R284 R295 R305 R316 R326 R337 R347 R358 R368 R379 R389 R400 R410 R421 R431 R442 R473-R476 R482-R485 R491-R494 = SamacSys_Parts:RC0402JR-133K3L: Thick Film Resistors - SMD 3.3K ohm 5% 50V General Purpose Source: Datasheet; DESCRIPTION: Thick Film Resistors - SMD 3.3K ohm 5% 50V General Purpose; HEIGHT: 0.4mm; MANUFACTURER_NAME: YAGEO (PHYCOMP); MANUFACTURER_PART_NUMBER: RC0402JR-133K3L; MOUSER_PART_NUMBER: 603-RC0402JR-133K3L; MOUSER_PRICE-STOCK: https://www.mouser.co.uk/ProductDetail/Yageo/RC0402JR-133K3L/?qs=fPU49sp6fCKWmtEENw96pg%3D%3D
R97 R99 R100 R134 R135 R144-R146 R172 R173 R182-R184 R193 R194 R206 R208 R210 R220 R222 R243-R245 R254 R255 R264-R266 R275 R276 R285-R287 R296 R297 R306-R308 R317 R318 R327-R329 R338 R339 R348-R350 R359 R360 R369-R371 R380 R381 R390-R392 R401 R402 R411-R413 R422 R423 R432-R434 R443-R458 R471 R499-R503 R506 R508 = SamacSys_Parts:ERJ-2RKF2002X: Precision Thick Film Chip Resistor, 0402, 0.063W Source: Datasheet <http://industrial.panasonic.com/cdbs/www-data/pdf/RDA0000/AOA0000C304.pdf>; DESCRIPTION: Precision Thick Film Chip Resistor, 0402, 0.063W; HEIGHT: 0.4mm; MANUFACTURER_NAME: Panasonic; MANUFACTURER_PART_NUMBER: ERJ-2RKF2002X; MOUSER_PART_NUMBER: 667-ERJ-2RKF2002X; MOUSER_PRICE-STOCK: https://www.mouser.co.uk/ProductDetail/Panasonic/ERJ-2RKF2002X?qs=H7k1u0Mp9JTOxRcN%252B6dzQw%3D%3D
R472 R481 R490 = SamacSys_Parts:GMR100HTCFAR100: ROHM - GMR100HTCFAR100 - CURRENT SENSE RES, AEC-Q200, 0R1, 2512 Source: Datasheet <https://componentsearchengine.com/Datasheets/2/GMR100HTCFAR100.pdf>; DESCRIPTION: ROHM - GMR100HTCFAR100 - CURRENT SENSE RES, AEC-Q200, 0R1, 2512; HEIGHT: 0.55mm; MANUFACTURER_NAME: ROHM Semiconductor; MANUFACTURER_PART_NUMBER: GMR100HTCFAR100; MOUSER_PART_NUMBER: 755-GMR100HTCFAR100; MOUSER_PRICE-STOCK: https://www.mouser.co.uk/ProductDetail/ROHM-Semiconductor/GMR100HTCFAR100?qs=chTDxNqvsyl8fRN%252BrBl%252BTA%3D%3D
R510 = SamacSys_Parts:CPF0402B1K21E1: TE Connectivity CPF Series Precision Thin Film Surface Mount Resistor 0402 Case 1.21k +/-0.1% 0.063W +/-25ppm/C Source: Datasheet; DESCRIPTION: TE Connectivity CPF Series Precision Thin Film Surface Mount Resistor 0402 Case 1.21k +/-0.1% 0.063W +/-25ppm/C; HEIGHT: 0.35mm; MANUFACTURER_NAME: TE Connectivity; MANUFACTURER_PART_NUMBER: CPF0402B1K21E1
R511 = SamacSys_Parts:ERA-2AEB7870X: Metal Thin Film Chip Resistor, 0402, 0.063W Source: Datasheet <http://industrial.panasonic.com/cdbs/www-data/pdf/RDM0000/AOA0000C307.pdf>; DESCRIPTION: Metal Thin Film Chip Resistor, 0402, 0.063W; HEIGHT: 0.4mm; MANUFACTURER_NAME: Panasonic; MANUFACTURER_PART_NUMBER: ERA-2AEB7870X
R512 = SamacSys_Parts:TNPW0402100RBYEP: Check availability <https://pricing.snapeda.com/parts/TNPW0402100RBYEP/Vishay/view-part?ref=eda>; AVAILABILITY: In Stock; DESCRIPTION: 100 Ohms ±0.1% 0.063W, 1/16W Chip Resistor 0402 (1005 Metric) Anti-Sulfur, Automotive AEC-Q200, Moisture Resistant Thin Film; MF: Vishay; MP: TNPW0402100RBYEP; PACKAGE: 1005 Stackpole; PRICE: None; PURCHASE-URL: https://pricing.snapeda.com/search/part/TNPW0402100RBYEP/?ref=eda
R513-R521 = SamacSys_Parts:CRG0402ZR: 0 0402 Thick Film Surface Mount Fixed Resistor +/-0% 0.063W CRG0402ZR Source: Datasheet <https://www.te.com/commerce/DocumentDelivery/DDEController?Action=showdoc&DocId=Data Sheet1773204JpdfEnglishENG_DS_1773204_J.pdf6-1622826-4>; DESCRIPTION: 0 0402 Thick Film Surface Mount Fixed Resistor +/-0% 0.063W CRG0402ZR; HEIGHT: 0.4mm; MANUFACTURER_NAME: TE Connectivity; MANUFACTURER_PART_NUMBER: CRG0402ZR; MOUSER_PART_NUMBER: 279-CRG0402ZR; MOUSER_PRICE-STOCK: https://www.mouser.co.uk/ProductDetail/TE-Connectivity-Holsworthy/CRG0402ZR?qs=n4i9pByFsMS7bfq5JAG5yw%3D%3D
T1 = SamacSys_Parts:782482_33VC: 1:1.33 Through Hole Telecom Transformer, 310uH, 600m Source: Datasheet <https://www.murata-ps.com/data/magnetics/kmp_782482.pdf>; DESCRIPTION: 1:1.33 Through Hole Telecom Transformer, 310uH, 600m; HEIGHT: 6.35mm; MANUFACTURER_NAME: Murata Electronics; MANUFACTURER_PART_NUMBER: 782482/33VC; MOUSER_PART_NUMBER: 580-782482/33VC; MOUSER_PRICE-STOCK: https://www.mouser.co.uk/ProductDetail/Murata-Power-Solutions/782482-33VC?qs=2G8o3QlzqXp4rFQDC5ba8Q%3D%3D
U$1-U$4 = SamacSys_Parts:PTS120601B1K00P100: Board Mount Temperature Sensors 1206 1Kohms RTD 0.1mA-0.25mA
U$5 U$7 U$9 U$10 U$14 U$15 = SamacSys_Parts:THROUGH_HOLE
UC1 = SamacSys_Parts:NUCLEO_H723ZG